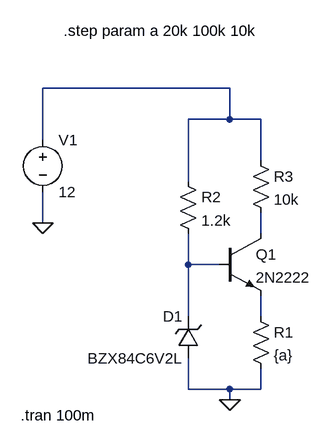
[diagram p0: schematic current_reg.asc]
current_reg.asc, the LTspice schematic file:
Version 4
SHEET 1 880 680
WIRE 240 -96 -48 -96
WIRE 240 -48 240 -96
WIRE 240 -48 176 -48
WIRE 288 -48 240 -48
WIRE -48 -16 -48 -96
WIRE 288 16 288 -48
WIRE 176 48 176 -48
WIRE -48 112 -48 64
WIRE 288 128 288 96
WIRE 176 176 176 128
WIRE 224 176 176 176
WIRE 176 256 176 176
WIRE 288 256 288 224
WIRE 176 368 176 320
WIRE 240 368 176 368
WIRE 288 368 288 336
WIRE 288 368 240 368
WIRE 240 384 240 368
FLAG 240 384 0
FLAG -48 112 0
SYMBOL npn 224 128 R0
SYMATTR InstName Q1
SYMATTR Value 2N2222
SYMBOL zener 192 320 R180
WINDOW 0 24 64 Left 2
WINDOW 3 24 0 Left 2
SYMATTR InstName D1
SYMATTR Value BZX84C6V2L
SYMATTR Description Diode
SYMATTR Type diode
SYMBOL res 272 240 R0
SYMATTR InstName R1
SYMATTR Value {a}
SYMBOL res 160 32 R0
SYMATTR InstName R2
SYMATTR Value 1.2k
SYMBOL res 272 0 R0
SYMATTR InstName R3
SYMATTR Value 10k
SYMBOL voltage -48 -32 R0
WINDOW 123 0 0 Left 2
WINDOW 39 0 0 Left 2
SYMATTR InstName V1
SYMATTR Value 12
TEXT -82 408 Left 2 !.tran 100m
TEXT -16 -184 Left 2 !.step param a 20k 100k 10k

The netlist it stands for:
* current_reg.asc
Q1 N002 N003 N004 0 2N2222
D1 0 N003 BZX84C6V2L
R1 N004 0 {a}
R2 N001 N003 1.2k
R3 N001 N002 10k
V1 N001 0 12
.model D D
.lib standard.dio
.model NPN NPN
.model PNP PNP
.lib standard.bjt
.tran 100m
.step param a 20k 100k 10k
.backanno
.end